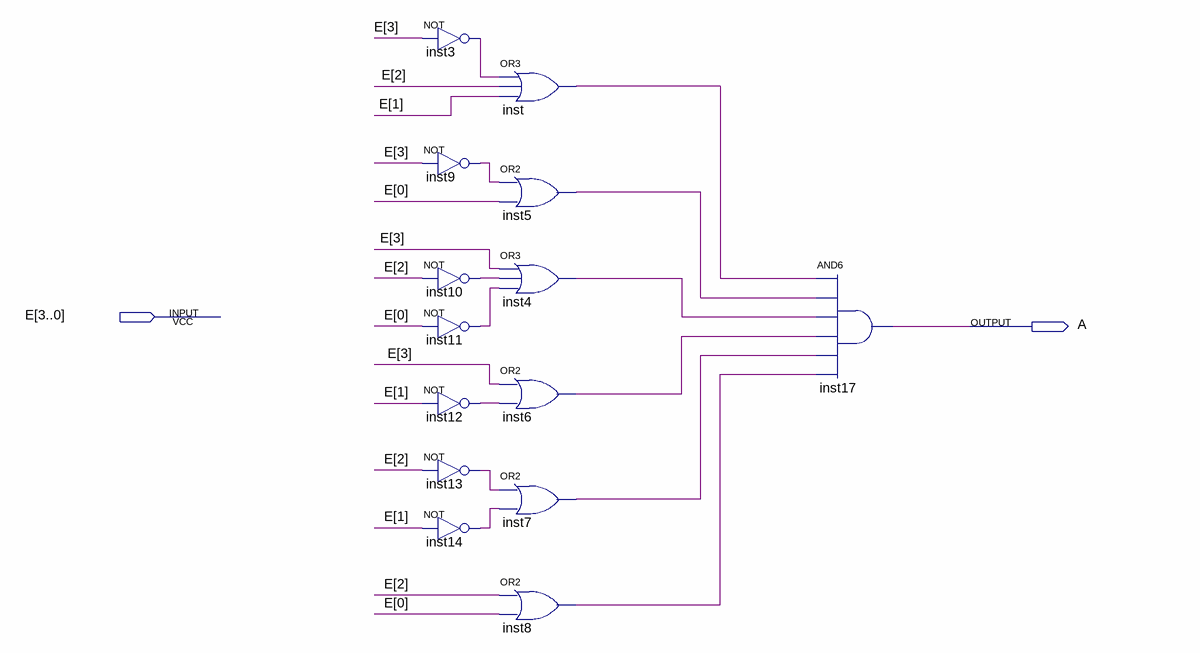
[diagram p0: schematic sheet]
// Quartus schematic seg_A.bdf as structural Verilog: 14 symbols, 2 pins
module seg_A (
  input  [3:0] E,
  output A
);

  wire inst3_out, inst4_out, inst5_out, inst6_out, inst7_out, inst8_out, inst9_out, inst10_out, inst11_out,
       inst12_out, inst13_out, inst14_out, inst_out;

  not inst3 (inst3_out, E[3]);
  not inst9 (inst9_out, E[3]);
  not inst10 (inst10_out, E[2]);
  not inst11 (inst11_out, E[0]);
  not inst12 (inst12_out, E[1]);
  not inst13 (inst13_out, E[2]);
  not inst14 (inst14_out, E[1]);
  or inst (inst_out, inst3_out, E[2], E[1]);
  or inst5 (inst5_out, inst9_out, E[0]);
  or inst4 (inst4_out, E[3], inst10_out, inst11_out);
  or inst6 (inst6_out, E[3], inst12_out);
  or inst7 (inst7_out, inst13_out, inst14_out);
  or inst8 (inst8_out, E[2], E[0]);
  and inst17 (A, inst_out, inst5_out, inst4_out, inst6_out, inst7_out, inst8_out);
endmodule
